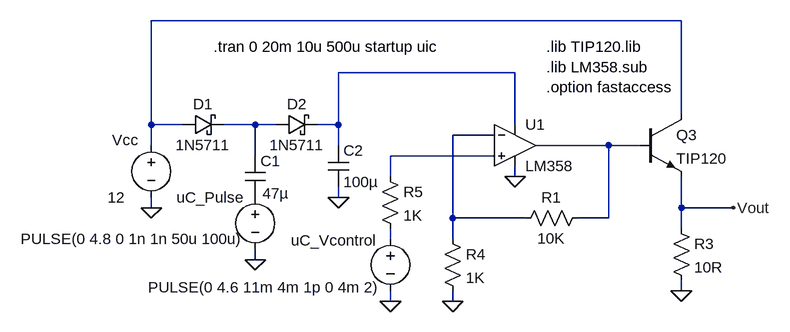
[diagram p0: schematic Voltage Multiplier.asc]
Voltage Multiplier.asc, the LTspice schematic file:
Version 4
SHEET 1 1872 740
WIRE 880 -288 64 -288
WIRE 624 -208 352 -208
WIRE 880 -144 880 -288
WIRE 64 -128 64 -288
WIRE 112 -128 64 -128
WIRE 224 -128 176 -128
WIRE 256 -128 224 -128
WIRE 352 -128 352 -208
WIRE 352 -128 320 -128
WIRE 624 -128 624 -208
WIRE 592 -112 528 -112
WIRE 64 -96 64 -128
WIRE 352 -96 352 -128
WIRE 768 -96 656 -96
WIRE 816 -96 768 -96
WIRE 224 -80 224 -128
WIRE 592 -80 432 -80
WIRE 432 -48 432 -80
WIRE 624 -48 624 -64
WIRE 352 -16 352 -32
WIRE 64 0 64 -16
WIRE 880 0 880 -48
WIRE 960 0 880 0
WIRE 528 16 528 -112
WIRE 640 16 528 16
WIRE 768 16 768 -96
WIRE 768 16 720 16
WIRE 880 32 880 0
WIRE 432 48 432 32
WIRE 528 48 528 16
WIRE 224 80 224 64
WIRE 880 128 880 112
WIRE 432 144 432 128
WIRE 528 144 528 128
FLAG 224 80 0
FLAG 64 0 0
FLAG 960 0 Vout
FLAG 880 128 0
FLAG 528 144 0
FLAG 624 -48 0
FLAG 432 144 0
FLAG 352 -16 0
SYMBOL voltage 64 -112 R0
WINDOW 0 -60 8 Left 2
WINDOW 3 -67 96 Left 2
SYMATTR InstName Vcc
SYMATTR Value 12
SYMBOL voltage 224 -32 R0
WINDOW 123 0 0 Left 0
WINDOW 39 0 0 Left 0
WINDOW 0 -121 16 Left 2
WINDOW 3 -361 80 Left 2
SYMATTR InstName uC_Pulse
SYMATTR Value PULSE(0 4.8 0 1n 1n 50u 100u)
SYMBOL schottky 112 -112 R270
WINDOW 0 32 32 VTop 2
WINDOW 3 0 32 VBottom 2
SYMATTR InstName D1
SYMATTR Value 1N5711
SYMATTR Description Diode
SYMATTR Type diode
SYMBOL cap 208 -80 R0
WINDOW 3 27 58 Left 2
SYMATTR InstName C1
SYMATTR Value 47µ
SYMBOL schottky 256 -112 R270
WINDOW 0 32 32 VTop 2
WINDOW 3 0 32 VBottom 2
SYMATTR InstName D2
SYMATTR Value 1N5711
SYMATTR Description Diode
SYMATTR Type diode
SYMBOL npn 816 -144 R0
SYMATTR InstName Q3
SYMATTR Value TIP120
SYMATTR Prefix X
SYMBOL OpAmps\\opamp2 624 -160 R0
SYMATTR InstName U1
SYMATTR Value LM358
SYMBOL res 736 0 R90
WINDOW 0 0 56 VBottom 2
WINDOW 3 32 56 VTop 2
SYMATTR InstName R1
SYMATTR Value 10K
SYMBOL res 864 16 R0
SYMATTR InstName R3
SYMATTR Value 10R
SYMBOL res 512 32 R0
SYMATTR InstName R4
SYMATTR Value 1K
SYMBOL res 416 -64 R0
SYMATTR InstName R5
SYMATTR Value 1K
SYMBOL voltage 432 32 R0
WINDOW 0 -153 18 Left 2
WINDOW 3 -373 91 Left 2
WINDOW 123 0 0 Left 2
WINDOW 39 0 0 Left 2
SYMATTR InstName uC_Vcontrol
SYMATTR Value PULSE(0 4.6 11m 4m 1p 0 4m 2)
SYMBOL cap 336 -96 R0
SYMATTR InstName C2
SYMATTR Value 100µ
TEXT 160 -248 Left 2 !.tran 0 20m 10u 500u startup uic
TEXT 672 -248 Left 2 !.lib TIP120.lib\n.lib LM358.sub\n.option fastaccess

The netlist it stands for:
* Voltage Multiplier.asc
Vcc N001 0 12
V§uC_Pulse P001 0 PULSE(0 4.8 0 1n 1n 50u 100u)
D1 N001 N003 1N5711
C1 N003 P001 47µ
D2 N003 N002 1N5711
XQ3 N001 N005 Vout TIP120  ; pins C B E
XU1 N006 N004 N002 0 N005 LM358  ; pins In+ In- V+ V- OUT
R1 N005 N004 10K
R3 Vout 0 10R
R4 N004 0 1K
R5 N006 N007 1K
V§uC_Vcontrol N007 0 PULSE(0 4.6 11m 4m 1p 0 4m 2)
C2 N002 0 100µ
.model D D
.lib standard.dio
.tran 0 20m 10u 500u startup uic
.lib TIP120.lib
.lib LM358.sub
.option fastaccess
.backanno
.end